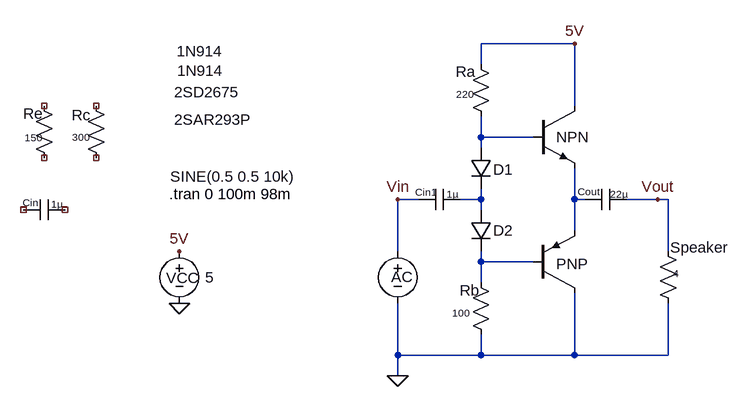
[diagram p0: schematic CLASS AB Amplifier.asc]
CLASS AB Amplifier.asc, the LTspice schematic file:
Version 4
SHEET 1 880 680
WIRE 256 -176 112 -176
WIRE 112 -144 112 -176
WIRE 256 -80 256 -176
WIRE 112 -32 112 -64
WIRE 192 -32 112 -32
WIRE 112 -16 112 -32
WIRE 16 64 -16 64
WIRE 112 64 112 48
WIRE 112 64 80 64
WIRE 256 64 256 16
WIRE 272 64 256 64
WIRE 384 64 336 64
WIRE 400 64 384 64
WIRE 112 80 112 64
WIRE 256 112 256 64
WIRE -16 144 -16 64
WIRE 400 144 400 64
WIRE 112 160 112 144
WIRE 192 160 112 160
WIRE 112 192 112 160
WIRE -16 304 -16 224
WIRE 112 304 112 272
WIRE 112 304 -16 304
WIRE 256 304 256 208
WIRE 256 304 112 304
WIRE 400 304 400 224
WIRE 400 304 256 304
WIRE -16 336 -16 304
FLAG 256 -176 5V
FLAG 384 64 Vout
FLAG -352 144 5V
FLAG -352 224 0
FLAG -16 64 Vin
FLAG -16 336 0
SYMBOL npn 192 -80 R0
WINDOW 0 36 48 Left 2
WINDOW 3 -552 -21 Left 2
SYMATTR InstName NPN
SYMATTR Value 2SD2675
SYMBOL res -496 -96 R0
WINDOW 0 -22 30 Left 2
WINDOW 3 -21 64 Left 1
SYMATTR InstName Rc
SYMATTR Value 300
SYMBOL res -576 -96 R0
WINDOW 0 -16 28 Left 2
WINDOW 3 -14 65 Left 1
SYMATTR InstName Re
SYMATTR Value 150
SYMBOL voltage -16 128 R0
WINDOW 123 0 0 Left 0
WINDOW 39 0 0 Left 0
WINDOW 0 -10 55 Left 2
WINDOW 3 -350 -99 Left 2
SYMATTR InstName AC
SYMATTR Value SINE(0.5 0.5 10k)
SYMBOL voltage -352 128 R0
WINDOW 0 -20 57 Left 2
WINDOW 3 40 56 Left 2
WINDOW 123 0 0 Left 0
WINDOW 39 0 0 Left 0
SYMATTR InstName VCC
SYMATTR Value 5
SYMBOL cap -528 64 R90
WINDOW 0 15 53 VBottom 1
WINDOW 3 -3 12 VTop 1
SYMATTR InstName Cin
SYMATTR Value 1µ
SYMBOL pnp 192 208 M180
WINDOW 0 36 45 Left 2
WINDOW 3 -552 267 Left 2
SYMATTR InstName PNP
SYMATTR Value 2SAR293P
SYMBOL res 384 128 R0
WINDOW 0 19 10 Left 2
WINDOW 3 24 50 Left 1
SYMATTR InstName Speaker
SYMATTR Value 4
SYMBOL cap 80 48 R90
WINDOW 0 15 53 VBottom 1
WINDOW 3 -3 12 VTop 1
SYMATTR InstName Cin1
SYMATTR Value 1µ
SYMBOL res 96 -160 R0
WINDOW 0 -23 27 Left 2
WINDOW 3 -22 62 Left 1
SYMATTR InstName Ra
SYMATTR Value 220
SYMBOL res 96 176 R0
WINDOW 0 -17 28 Left 2
WINDOW 3 -28 63 Left 1
SYMATTR InstName Rb
SYMATTR Value 100
SYMBOL diode 96 -16 R0
WINDOW 0 35 34 Left 2
WINDOW 3 -452 -148 Left 2
SYMATTR InstName D1
SYMATTR Value 1N914
SYMBOL diode 96 80 R0
WINDOW 0 35 32 Left 2
WINDOW 3 -451 -214 Left 2
SYMATTR InstName D2
SYMATTR Value 1N914
SYMBOL cap 336 48 R90
WINDOW 0 14 58 VBottom 1
WINDOW 3 -3 12 VTop 1
SYMATTR InstName Cout
SYMATTR Value 22µ
TEXT -368 56 Left 2 !.tran 0 100m 98m

The netlist it stands for:
* CLASS AB Amplifier.asc
Q§NPN 5V N001 N003 0 2SD2675
Rc NC_01 NC_02 300
Re NC_03 NC_04 150
V§AC Vin 0 SINE(0.5 0.5 10k)
VCC 5V 0 5
Cin NC_05 NC_06 1µ
Q§PNP 0 N004 N003 0 2SAR293P
R§Speaker Vout 0 4
Cin1 N002 Vin 1µ
Ra 5V N001 220
Rb N004 0 100
D1 N001 N002 1N914
D2 N002 N004 1N914
Cout Vout N003 22µ
.model D D
.lib standard.dio
.model NPN NPN
.model PNP PNP
.lib standard.bjt
.tran 0 100m 98m
.backanno
.end